# EAGLE design lcard_repeater (EAGLE 6.6.0)
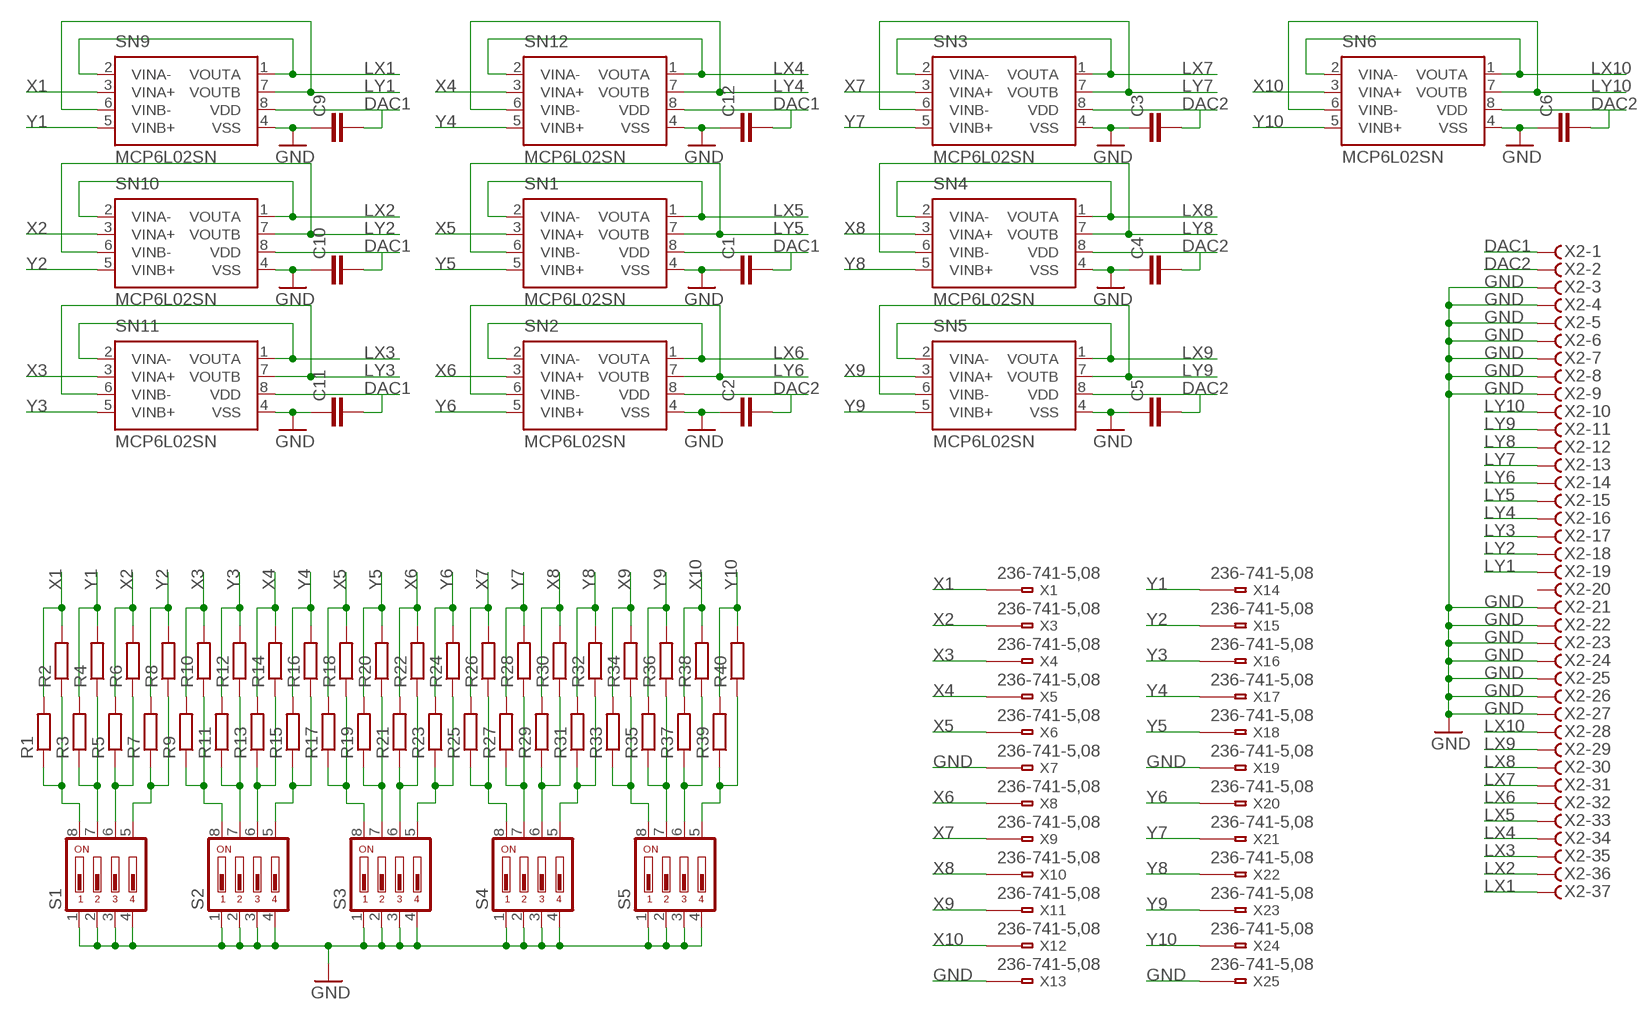
[diagram p0: schematic, sheet 1]

## Parts
C1  C-EUC1206  [C1206]
C2  C-EUC1206  [C1206]
C3  C-EUC1206  [C1206]
C4  C-EUC1206  [C1206]
C5  C-EUC1206  [C1206]
C6  C-EUC1206  [C1206]
C9  C-EUC1206  [C1206]
C10  C-EUC1206  [C1206]
C11  C-EUC1206  [C1206]
C12  C-EUC1206  [C1206]
R1  R-EU_R1206  [R1206]
R2  R-EU_R1206  [R1206]
R3  R-EU_R1206  [R1206]
R4  R-EU_R1206  [R1206]
R5  R-EU_R1206  [R1206]
R6  R-EU_R1206  [R1206]
R7  R-EU_R1206  [R1206]
R8  R-EU_R1206  [R1206]
R9  R-EU_R1206  [R1206]
R10  R-EU_R1206  [R1206]
R11  R-EU_R1206  [R1206]
R12  R-EU_R1206  [R1206]
R13  R-EU_R1206  [R1206]
R14  R-EU_R1206  [R1206]
R15  R-EU_R1206  [R1206]
R16  R-EU_R1206  [R1206]
R17  R-EU_R1206  [R1206]
R18  R-EU_R1206  [R1206]
R19  R-EU_R1206  [R1206]
R20  R-EU_R1206  [R1206]
R21  R-EU_R1206  [R1206]
R22  R-EU_R1206  [R1206]
R23  R-EU_R1206  [R1206]
R24  R-EU_R1206  [R1206]
R25  R-EU_R1206  [R1206]
R26  R-EU_R1206  [R1206]
R27  R-EU_R1206  [R1206]
R28  R-EU_R1206  [R1206]
R29  R-EU_R1206  [R1206]
R30  R-EU_R1206  [R1206]
R31  R-EU_R1206  [R1206]
R32  R-EU_R1206  [R1206]
R33  R-EU_R1206  [R1206]
R34  R-EU_R1206  [R1206]
R35  R-EU_R1206  [R1206]
R36  R-EU_R1206  [R1206]
R37  R-EU_R1206  [R1206]
R38  R-EU_R1206  [R1206]
R39  R-EU_R1206  [R1206]
R40  R-EU_R1206  [R1206]
S1  DS04  [DS-04]
S2  DS04  [DS-04]
S3  DS04  [DS-04]
S4  DS04  [DS-04]
S5  DS04  [DS-04]
SN1  MCP6L02SN  [SOIC-08LG]
SN2  MCP6L02SN  [SOIC-08LG]
SN3  MCP6L02SN  [SOIC-08LG]
SN4  MCP6L02SN  [SOIC-08LG]
SN5  MCP6L02SN  [SOIC-08LG]
SN6  MCP6L02SN  [SOIC-08LG]
SN9  MCP6L02SN  [SOIC-08LG]
SN10  MCP6L02SN  [SOIC-08LG]
SN11  MCP6L02SN  [SOIC-08LG]
SN12  MCP6L02SN  [SOIC-08LG]
X1  236-741-5,08  [236-4XX]
X2  F37DS  [F37D]
X3  236-741-5,08  [236-4XX]
X4  236-741-5,08  [236-4XX]
X5  236-741-5,08  [236-4XX]
X6  236-741-5,08  [236-4XX]
X7  236-741-5,08  [236-4XX]
X8  236-741-5,08  [236-4XX]
X9  236-741-5,08  [236-4XX]
X10  236-741-5,08  [236-4XX]
X11  236-741-5,08  [236-4XX]
X12  236-741-5,08  [236-4XX]
X13  236-741-5,08  [236-4XX]
X14  236-741-5,08  [236-4XX]
X15  236-741-5,08  [236-4XX]
X16  236-741-5,08  [236-4XX]
X17  236-741-5,08  [236-4XX]
X18  236-741-5,08  [236-4XX]
X19  236-741-5,08  [236-4XX]
X20  236-741-5,08  [236-4XX]
X21  236-741-5,08  [236-4XX]
X22  236-741-5,08  [236-4XX]
X23  236-741-5,08  [236-4XX]
X24  236-741-5,08  [236-4XX]
X25  236-741-5,08  [236-4XX]

## Nets
DAC1: C1.2 C9.2 C10.2 C11.2 C12.2 SN1.8(VDD) SN9.8(VDD) SN10.8(VDD) SN11.8(VDD) SN12.8(VDD) X2.1
DAC2: C2.2 C3.2 C4.2 C5.2 C6.2 SN2.8(VDD) SN3.8(VDD) SN4.8(VDD) SN5.8(VDD) SN6.8(VDD) X2.2
GND: C1.1 C2.1 C3.1 C4.1 C5.1 C6.1 C9.1 C10.1 C11.1 C12.1 S1.1 S1.2 S1.3 S1.4 S2.1 S2.2 S2.3 S2.4 S3.1 S3.2 S3.3 S3.4 S4.1 S4.2 S4.3 S4.4 S5.1 S5.2 S5.3 S5.4 SN1.4(VSS) SN2.4(VSS) SN3.4(VSS) SN4.4(VSS) SN5.4(VSS) SN6.4(VSS) SN9.4(VSS) SN10.4(VSS) SN11.4(VSS) SN12.4(VSS) X2.3 X2.4 X2.5 X2.6 X2.7 X2.8 X2.9 X2.21 X2.22 X2.23 X2.24 X2.25 X2.26 X2.27 X7.1@2(B1) X13.1@2(B1) X19.1@2(B1) X25.1@2(B1)
LX1: SN9.1(VOUTA) SN9.2(VINA-) X2.37
LX2: SN10.1(VOUTA) SN10.2(VINA-) X2.36
LX3: SN11.1(VOUTA) SN11.2(VINA-) X2.35
LX4: SN12.1(VOUTA) SN12.2(VINA-) X2.34
LX5: SN1.1(VOUTA) SN1.2(VINA-) X2.33
LX6: SN2.1(VOUTA) SN2.2(VINA-) X2.32
LX7: SN3.1(VOUTA) SN3.2(VINA-) X2.31
LX8: SN4.1(VOUTA) SN4.2(VINA-) X2.30
LX9: SN5.1(VOUTA) SN5.2(VINA-) X2.29
LX10: SN6.1(VOUTA) SN6.2(VINA-) X2.28
LY1: SN9.6(VINB-) SN9.7(VOUTB) X2.19
LY2: SN10.6(VINB-) SN10.7(VOUTB) X2.18
LY3: SN11.6(VINB-) SN11.7(VOUTB) X2.17
LY4: SN12.6(VINB-) SN12.7(VOUTB) X2.16
LY5: SN1.6(VINB-) SN1.7(VOUTB) X2.15
LY6: SN2.6(VINB-) SN2.7(VOUTB) X2.14
LY7: SN3.6(VINB-) SN3.7(VOUTB) X2.13
LY8: SN4.6(VINB-) SN4.7(VOUTB) X2.12
LY9: SN5.6(VINB-) SN5.7(VOUTB) X2.11
LY10: SN6.6(VINB-) SN6.7(VOUTB) X2.10
N$1: R1.1 R2.1 S1.8
N$2: R3.1 R4.1 S1.7
N$3: R5.1 R6.1 S1.6
N$4: R7.1 R8.1 S1.5
N$5: R33.1 R34.1 S5.8
N$6: R35.1 R36.1 S5.7
N$7: R37.1 R38.1 S5.6
N$8: R39.1 R40.1 S5.5
N$10: R9.1 R10.1 S2.8
N$11: R11.1 R12.1 S2.7
N$12: R13.1 R14.1 S2.6
N$13: R15.1 R16.1 S2.5
N$19: R17.1 R18.1 S3.8
N$20: R19.1 R20.1 S3.7
N$21: R21.1 R22.1 S3.6
N$22: R23.1 R24.1 S3.5
N$28: R25.1 R26.1 S4.8
N$29: R27.1 R28.1 S4.7
N$30: R29.1 R30.1 S4.6
N$31: R31.1 R32.1 S4.5
X1: R1.2 R2.2 SN9.3(VINA+) X1.1@2(B1)
X2: R5.2 R6.2 SN10.3(VINA+) X3.1@2(B1)
X3: R9.2 R10.2 SN11.3(VINA+) X4.1@2(B1)
X4: R13.2 R14.2 SN12.3(VINA+) X5.1@2(B1)
X5: R17.2 R18.2 SN1.3(VINA+) X6.1@2(B1)
X6: R21.2 R22.2 SN2.3(VINA+) X8.1@2(B1)
X7: R25.2 R26.2 SN3.3(VINA+) X9.1@2(B1)
X8: R29.2 R30.2 SN4.3(VINA+) X10.1@2(B1)
X9: R33.2 R34.2 SN5.3(VINA+) X11.1@2(B1)
X10: R37.2 R38.2 SN6.3(VINA+) X12.1@2(B1)
Y1: R3.2 R4.2 SN9.5(VINB+) X14.1@2(B1)
Y2: R7.2 R8.2 SN10.5(VINB+) X15.1@2(B1)
Y3: R11.2 R12.2 SN11.5(VINB+) X16.1@2(B1)
Y4: R15.2 R16.2 SN12.5(VINB+) X17.1@2(B1)
Y5: R19.2 R20.2 SN1.5(VINB+) X18.1@2(B1)
Y6: R23.2 R24.2 SN2.5(VINB+) X20.1@2(B1)
Y7: R27.2 R28.2 SN3.5(VINB+) X21.1@2(B1)
Y8: R31.2 R32.2 SN4.5(VINB+) X22.1@2(B1)
Y9: R35.2 R36.2 SN5.5(VINB+) X23.1@2(B1)
Y10: R39.2 R40.2 SN6.5(VINB+) X24.1@2(B1)
Unconnected: X1.1@1(A1) X2.20 X3.1@1(A1) X4.1@1(A1) X5.1@1(A1) X6.1@1(A1) X7.1@1(A1) X8.1@1(A1) X9.1@1(A1) X10.1@1(A1) X11.1@1(A1) X12.1@1(A1) X13.1@1(A1) X14.1@1(A1) X15.1@1(A1) X16.1@1(A1) X17.1@1(A1) X18.1@1(A1) X19.1@1(A1) X20.1@1(A1) X21.1@1(A1) X22.1@1(A1) X23.1@1(A1) X24.1@1(A1) X25.1@1(A1)

## Library data of the parts
C1-C6 C9-C12 = lcard_repeater:C-EU: CAPACITOR, European symbol
R1-R40 = lcard_repeater:R-EU_: RESISTOR, European symbol
S1-S5 = lcard_repeater:DS04: DIL/CODE SWITCH; OC_FARNELL: 9471570; OC_NEWARK: unknown
SN1-SN6 SN9-SN12 = lcard_repeater:MCP6L02: Universal High Brightness LED Driver Source: www.supertex.com .. led_driver_ics_SG.pdf; MPN: MXHV9910B; OC_FARNELL: unknown; OC_NEWARK: 15R9731
X1 X3-X25 = lcard_repeater:236: Anreihbare Einzelklemme 2,5 mm² 16A Rastermaß 5/5,08 | 7,5/7,62 | 10/10,16
X2 = lcard_repeater:F37?S: SUB-D; OC_FARNELL: unknown; OC_NEWARK: unknown

## Board
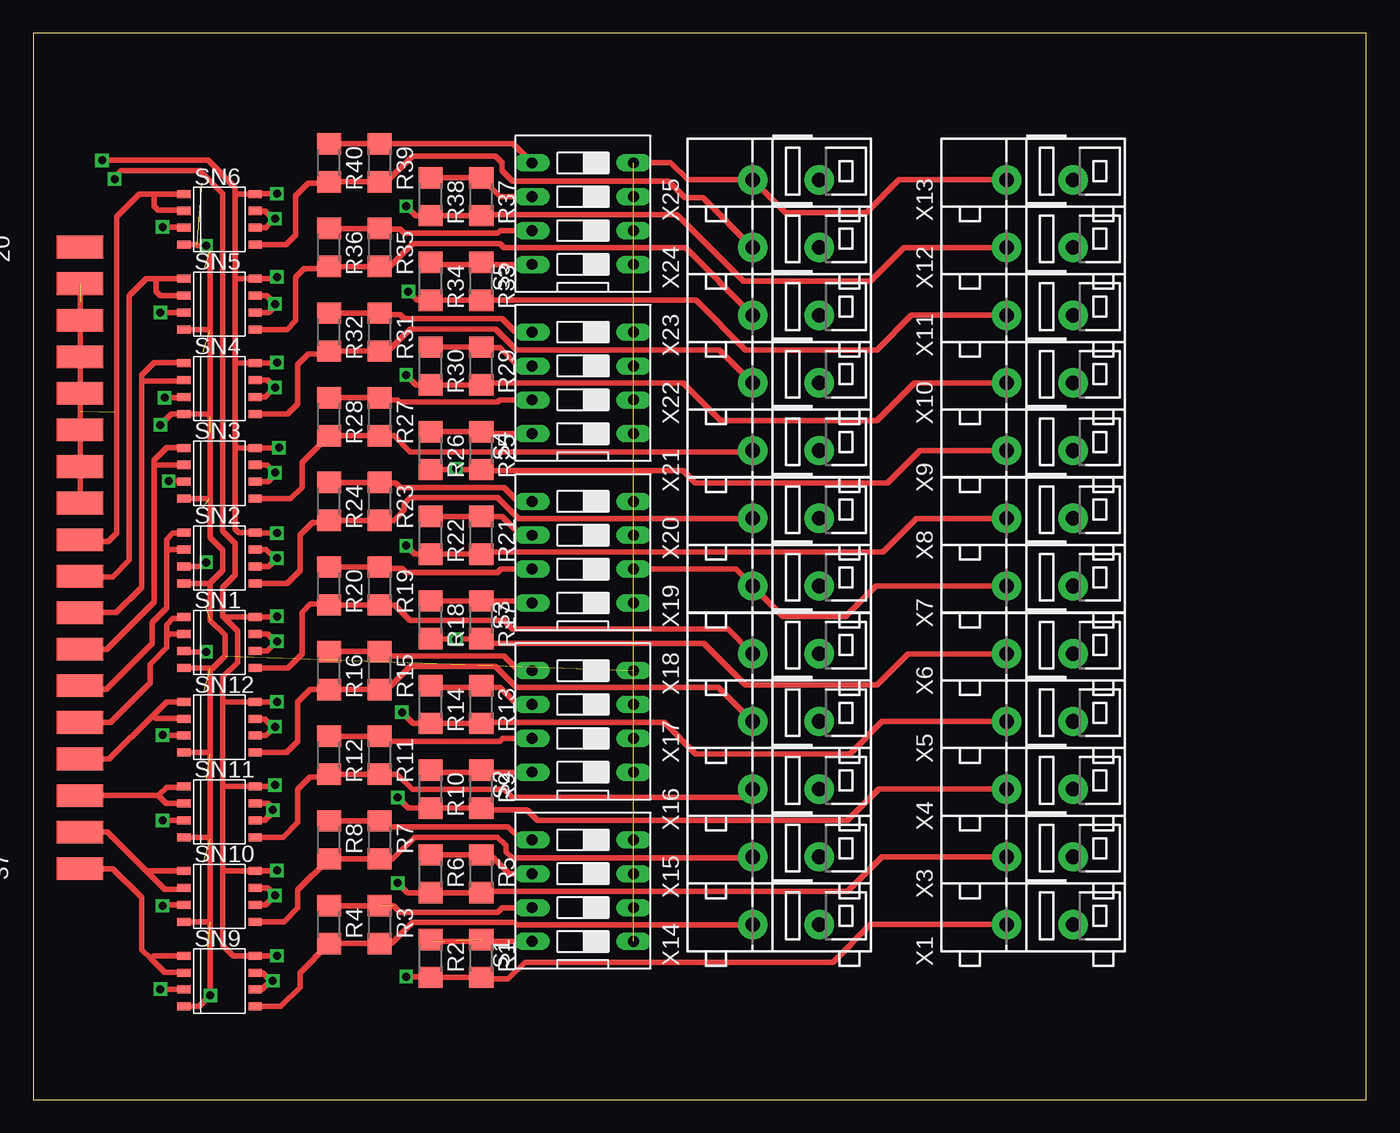
[diagram p1: board, top side]
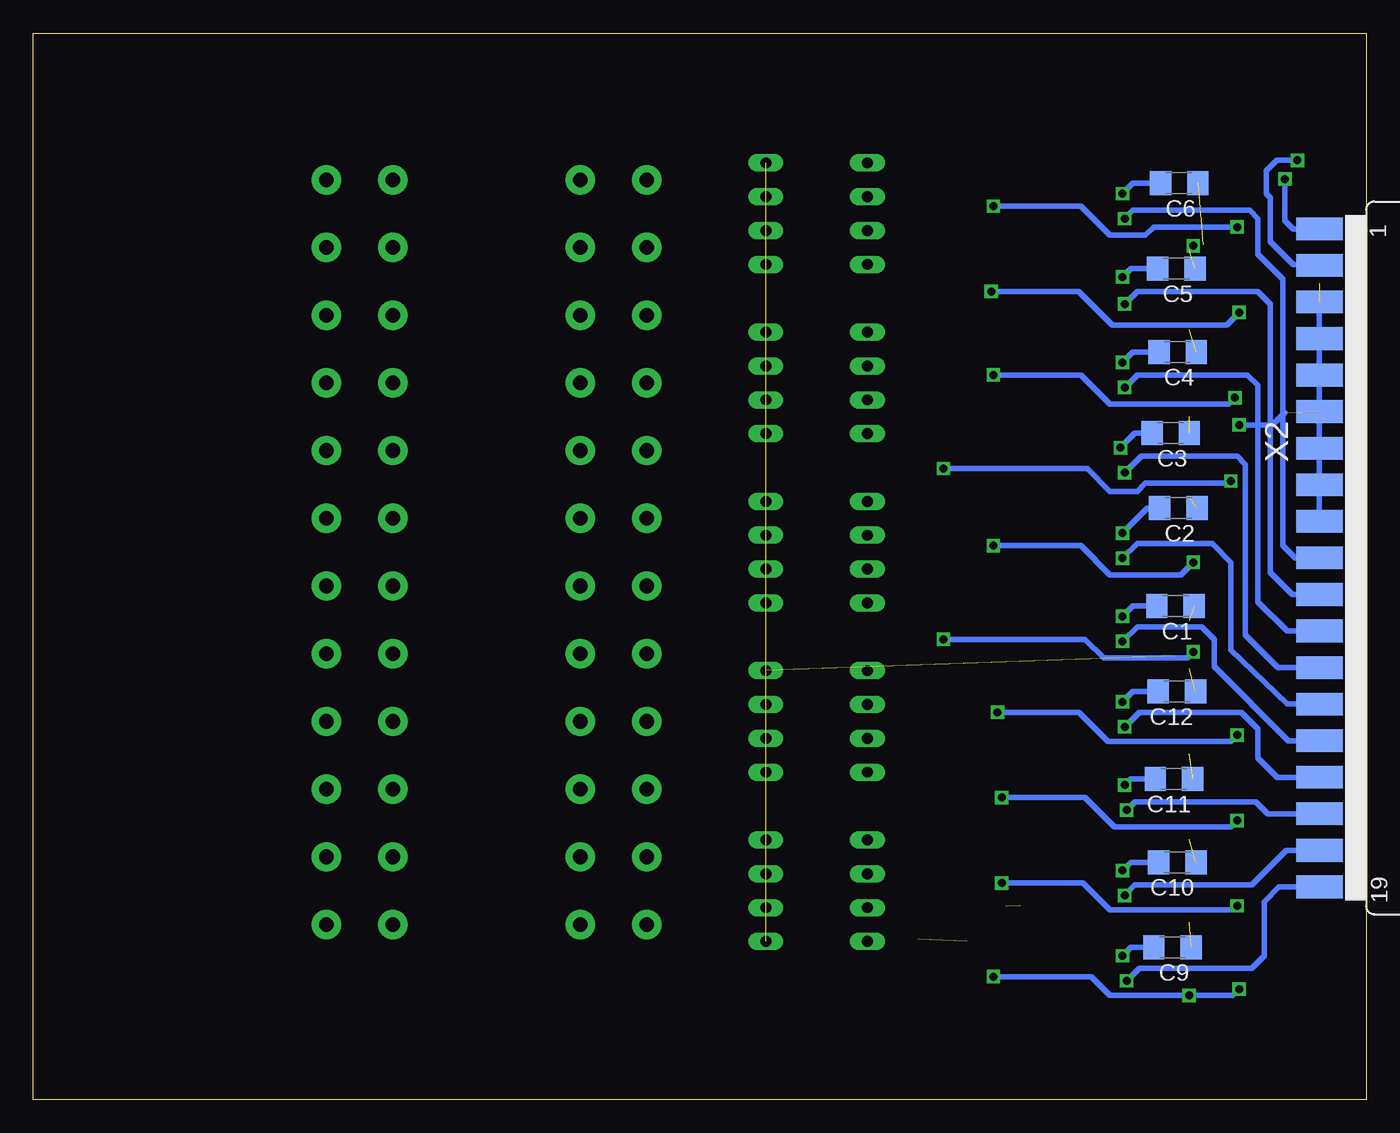
[diagram p2: board, bottom side, seen from below]

Size 100 x 80 mm. Coordinates in mm from the lower left corner, seen from the top.
Outline: 0,0 100,0 100,80 0,80 0,0
Copper layers (1*16): Top 0.035mm / dielectric 1.5mm / Bottom 0.035mm
Design rules "default": minimum track width 10mil, minimum drill 24mil, track to track 8mil, track to pad 8mil, pad to pad 8mil, via to via 8mil, smd to smd 8mil, copper to edge 40mil, drill to drill 8mil, minimum pad ring 10mil, minimum via ring 8mil, stop-mask expansion 4mil, vias tented up to drill 0mil, thermal gap 10mil

### Footprints (pad centres in the part's own frame; a part is rotated, then mirrored left to right if it is on the bottom)
C1206 = smd 1.6 x 1.8: 1 -1.4,0; 2 1.4,0
R1206 = smd 1.6 x 1.803: 1 -1.422,0; 2 1.422,0
DS-04 = drill 0.813 long: 1 -3.81,-3.81; 2 -1.27,-3.81; 3 1.27,-3.81; 4 3.81,-3.81; 5 3.81,3.81; 6 1.27,3.81; 7 -1.27,3.81; 8 -3.81,3.81
SOIC-08LG = smd 0.6 x 1: 1 -1.905,-2.675; 2 -0.635,-2.675; 3 0.635,-2.675; 4 1.905,-2.675; 5 1.905,2.675; 6 0.635,2.675; 7 -0.635,2.675; 8 -1.905,2.675
236-4XX = drill 1.1 pad 2.2: 1@1 0,-2.5; 1@2 0,2.5
F37D = smd 1.7 x 3.5: 1 -24.689,-6.045; 2 -21.946,-6.045; 3 -19.202,-6.045; 4 -16.459,-6.045; 5 -13.716,-6.045; 6 -10.973,-6.045; 7 -8.23,-6.045; 8 -5.486,-6.045; 9 -2.743,-6.045; 10 0,-6.045; 11 2.743,-6.045; 12 5.486,-6.045; 13 8.23,-6.045; 14 10.973,-6.045; 15 13.716,-6.045; 16 16.459,-6.045; 17 19.202,-6.045; 18 21.946,-6.045; 19 24.689,-6.045 | smd 1.7 x 3.5 bottom: 20 -23.317,-6.045; 21 -20.574,-6.045; 22 -17.831,-6.045; 23 -15.088,-6.045; 24 -12.344,-6.045; 25 -9.601,-6.045; 26 -6.858,-6.045; 27 -4.115,-6.045; 28 -1.372,-6.045; 29 1.372,-6.045; 30 4.115,-6.045; 31 6.858,-6.045; 32 9.601,-6.045; 33 12.344,-6.045; 34 15.088,-6.045; 35 17.831,-6.045; 36 20.574,-6.045; 37 23.317,-6.045

### Placement (x,y rotation side)
C1  14.31,37.02 180 bottom
C2  14.1,44.37 180 bottom
C3  14.67,49.99 180 bottom
C4  14.14,56.09 180 bottom
C5  14.24,62.34 180 bottom
C6  14.03,68.74 180 bottom
C9  14.53,11.41 180 bottom
C10  14.17,17.8 180 bottom
C11  14.42,24.05 180 bottom
C12  14.21,30.62 180 bottom
R1  33.61,10.59 270 top
R2  29.8,10.59 270 top
R3  25.99,13.13 270 top
R4  22.18,13.13 270 top
R5  33.61,16.94 270 top
R6  29.8,16.94 270 top
R7  25.99,19.48 270 top
R8  22.18,19.48 270 top
R9  33.61,23.29 270 top
R10  29.8,23.29 270 top
R11  25.99,25.83 270 top
R12  22.18,25.83 270 top
R13  33.61,29.64 270 top
R14  29.8,29.64 270 top
R15  25.99,32.18 270 top
R16  22.18,32.18 270 top
R17  33.61,35.99 270 top
R18  29.8,35.99 270 top
R19  25.99,38.53 270 top
R20  22.18,38.53 270 top
R21  33.61,42.34 270 top
R22  29.8,42.34 270 top
R23  25.99,44.88 270 top
R24  22.18,44.88 270 top
R25  33.61,48.69 270 top
R26  29.8,48.69 270 top
R27  25.99,51.23 270 top
R28  22.18,51.23 270 top
R29  33.61,55.04 270 top
R30  29.8,55.04 270 top
R31  25.99,57.58 270 top
R32  22.18,57.58 270 top
R33  33.61,61.39 270 top
R34  29.8,61.39 270 top
R35  25.99,63.93 270 top
R36  22.18,63.93 270 top
R37  33.61,67.74 270 top
R38  29.8,67.74 270 top
R39  25.99,70.28 270 top
R40  22.18,70.28 270 top
S1  41.23,15.67 90 top
S2  41.23,28.37 90 top
S3  41.23,41.07 90 top
S4  41.23,53.77 90 top
S5  41.23,66.47 90 top
SN1  13.97,34.29 270 top
SN2  13.97,40.64 270 top
SN3  13.97,46.99 270 top
SN4  13.97,53.34 270 top
SN5  13.97,59.69 270 top
SN6  13.97,66.04 270 top
SN9  13.97,8.89 270 top
SN10  13.97,15.24 270 top
SN11  13.97,21.59 270 top
SN12  13.97,27.94 270 top
X1  75.52,13.13 90 top
X2  -2.54,40.64 270 bottom
X3  75.52,18.21 90 top
X4  75.52,23.29 90 top
X5  75.52,28.37 90 top
X6  75.52,33.45 90 top
X7  75.52,38.53 90 top
X8  75.52,43.61 90 top
X9  75.52,48.69 90 top
X10  75.52,53.77 90 top
X11  75.52,58.85 90 top
X12  75.52,63.93 90 top
X13  75.52,69.01 90 top
X14  56.47,13.13 90 top
X15  56.47,18.21 90 top
X16  56.47,23.29 90 top
X17  56.47,28.37 90 top
X18  56.47,33.45 90 top
X19  56.47,38.53 90 top
X20  56.47,43.61 90 top
X21  56.47,48.69 90 top
X22  56.47,53.77 90 top
X23  56.47,58.85 90 top
X24  56.47,63.93 90 top
X25  56.47,69.01 90 top

### Tracks (layer width: path | path; a pad name or v marks a point on that pad's centre or on a via)
DAC1  (via drill 0.6)
  Top 0.406: 14.22,17.19 14.22,11.56 14.99,10.79 SN9.8 16.66,10.78 v18.28,10.78 | 14.22,17.19 14.22,23.59 | 14.22,23.59 14.22,30 | 14.22,17.19 14.26,17.14 SN10.8 18.24,17.14 v18.28,17.19 | 14.22,23.59 14.32,23.5 SN11.8 18.12,23.5 v18.12,23.59 | 14.22,30 14.37,29.84 SN12.8 v18.28,29.84 | 14.27,36.2 SN1.8 18.28,36.2 v18.28,36.25 | 14.27,36.2 14.22,36.25 14.22,38.44 15.16,39.38 15.16,41.72 14.22,42.66 14.22,67.97 12.5,69.69 6.56,69.69 6.09,69.22 v6.09,69.06 | 14.27,36.2 15.31,35.16 15.31,32.81 14.22,31.72 14.22,30
  Bottom 0.406: C1.2 17.51,37.02 v18.28,36.25 | C12.2 17.51,30.62 v18.28,29.84 | C11.2 17.66,24.05 v18.12,23.59 | C10.2 17.66,17.8 v18.28,17.19 | C9.2 17.65,11.41 v18.28,10.78 | v6.09,69.06 6.09,65.94 5.47,65.31 3.52,65.31 X2.1
DAC2  (via drill 0.6)
  Top 0.406: 15.16,49.06 15.16,42.81 15.42,42.55 SN2.8 16.69,42.5 v18.28,42.5 | 15.16,49.06 15.16,55.31 | 15.16,55.31 15.16,61.56 | 15.16,61.56 15.16,67.97 | 15.16,67.97 15.16,68.44 13.12,70.47 v5.16,70.47 | 15.16,67.97 15.18,67.94 SN6.8 16.67,67.97 v18.28,67.97 | 15.16,61.56 15.19,61.59 SN5.8 18.16,61.59 v18.28,61.72 | 15.16,55.31 15.22,55.24 SN4.8 18.21,55.24 v18.28,55.31 | 15.16,49.06 15.32,48.9 SN3.8 18.43,48.9 v18.44,48.91
  Bottom 0.406: C6.2 17.51,68.74 v18.28,67.97 | C5.2 17.66,62.34 v18.28,61.72 | C4.2 17.51,56.09 v18.28,55.31 | C3.2 17.35,49.99 v18.44,48.91 | C2.2 16.41,44.37 v18.28,42.5 | v5.16,70.47 6.72,70.47 7.5,69.69 7.5,67.97 7.19,67.66 7.19,64.38 5.47,62.66 3.58,62.66 X2.2
GND  (via drill 0.6)  (32 unrouted)
  Top 0.406: SN6.4 12.27,64.14 12.34,64.06 v12.97,64.06 13.28,63.75 13.28,57.81 | SN9.4 12.45,6.99 v13.28,7.81 13.28,13.28 | 13.28,13.28 13.28,19.53 | 13.28,19.53 13.28,25.94 | 13.28,25.94 13.28,32.34 | 13.28,45.16 13.28,51.25 | 13.28,51.25 13.28,57.81 | SN5.4 13.25,57.78 13.28,57.81 | 13.28,51.25 13.1,51.44 SN4.4 10.34,51.44 v9.53,50.62 | SN3.4 13.21,45.09 13.28,45.16 | SN2.4 13.11,38.73 13.28,38.75 | SN1.4 13.17,32.38 13.28,32.34 | SN10.4 13.23,13.34 13.28,13.28 | SN11.4 13.13,19.68 13.28,19.53 | SN12.4 13.18,26.04 13.28,25.94 | 13.28,38.75 13.28,35.94 14.38,34.84 14.38,33.28 13.44,32.34 13.28,32.34 | 13.28,45.16 13.28,42.19 14.22,41.25 14.22,39.69 13.28,38.75 | X7.1@2 63.22,38.53 60.94,36.25 56.25,36.25 X19.1@2 52.7,39.8 S3.2 | X13.1@2 64.95,69.01 62.5,66.56 56.42,66.56 X25.1@2 49.12,69.01 47.81,70.31 45.08,70.31 S5.4 | X2.21 X2.22 X2.23 X2.24 X2.25 X2.26 X2.27
  Bottom 0.406: X2.9 X2.8 | X2.8 | X2.8 X2.7 | X2.7 | X2.7 X2.6 X2.5 | X2.5 | X2.5 X2.4 | X2.4 | X2.4 X2.3 | X2.3 | v9.53,50.62 7.03,50.62 6.09,51.56
LX1
  Top 0.406: X2.37 5.96,17.32 8.12,15.16 8.12,11.25 8.83,10.55 | 8.83,10.55 9.84,9.53 11.29,9.53 SN9.2 | SN9.1 9.08,10.79 8.83,10.55
LX2
  Top 0.406: X2.36 5.56,20.07 8.59,17.03 | 8.59,17.03 9.84,15.78 11.2,15.78 SN10.2 | SN10.1 8.71,17.14 8.59,17.03
LX3
  Top 0.406: X2.35 9.37,22.81 | 9.37,22.81 10,23.44 11.24,23.44 SN11.1 | SN11.2 9.96,22.23 9.37,22.81
LX4
  Top 0.406: X2.34 5.71,25.55 8.98,28.83 | 8.98,28.83 10,29.84 SN12.1 | SN12.2 11.27,28.57 11.25,28.59 9.22,28.59 8.98,28.83
LX5
  Top 0.406: X2.33 5.8,28.3 8.75,31.25 8.75,32.66 10,33.91 10,34.69 | 10,34.69 10,35.62 10.47,36.09 11.19,36.09 SN1.1 | SN1.2 10.24,34.92 10,34.69
LX6
  Top 0.406: X2.32 3.23,31.04 2.97,30.78 5.47,30.78 8.91,34.22 8.91,35.78 10,36.88 10,41.09 | 10,41.09 10,42.03 10.47,42.5 11.25,42.5 SN2.1 | SN2.2 10.18,41.27 10,41.09
LX7
  Top 0.406: X2.31 5.5,33.78 9.06,37.34 9.06,47.5 | 9.06,47.5 9.06,47.97 10,48.91 11.28,48.91 SN3.1 | SN3.2 9.19,47.62 9.06,47.5
LX8
  Top 0.406: X2.30 6.21,36.52 8.12,38.44 8.12,53.91 | 8.12,53.91 8.12,54.38 9.06,55.31 11.23,55.31 SN4.1 | SN4.2 11.49,53.98 11.56,53.91 8.12,53.91
LX9
  Top 0.406: X2.29 3.56,39.22 5.94,39.22 7.19,40.47 7.19,60.31 8.47,61.59 9.06,61.59 | 9.06,61.59 SN5.1 | SN5.2 11.39,60.33 11.41,60.31 9.53,60.31 9.22,60.62 9.22,61.44 9.06,61.59
LX10
  Top 0.406: X2.28 3.64,41.88 5.62,41.88 6.25,42.5 6.25,66.25 7.95,67.94 9.06,67.94 | 9.06,67.94 SN6.1 | SN6.2 11.25,66.72 9.38,66.72 9.06,67.03 9.06,67.94
LY1  (via drill 0.6)
  Top 0.406: SN9.7 17.19,9.53 17.81,8.91 | 17.81,8.91 v17.97,8.91 | SN9.6 17.16,8.26 17.81,8.91
  Bottom 0.406: X2.19 6.55,15.95 7.66,14.84 7.66,10.78 8.59,9.84 17.03,9.84 v17.97,8.91
LY2  (via drill 0.6)
  Top 0.406: 16.71,15.94 SN10.7 17.56,15.88 v18.12,15.31 17.42,14.61 SN10.6
  Bottom 0.406: X2.18 5.99,18.69 8.59,16.09 17.34,16.09 v18.12,15.31
LY3  (via drill 0.6)
  Top 0.406: SN11.7 17.62,22.23 18.12,21.72 | 18.12,21.72 v17.97,21.72 | SN11.6 17.36,20.95 18.12,21.72
  Bottom 0.406: X2.17 7.38,21.44 8.28,22.34 17.34,22.34 v17.97,21.72
LY4  (via drill 0.6)
  Top 0.406: SN12.7 17.36,28.57 17.97,27.97 v18.12,27.97 17.46,27.3 SN12.6
  Bottom 0.406: X2.16 6.68,24.18 8.12,25.62 8.12,27.81 9.38,29.06 17.03,29.06 v18.12,27.97
LY5  (via drill 0.6)
  Top 0.406: SN1.7 17.57,34.92 18.12,34.38 v18.28,34.38 17.56,33.66 SN1.6
  Bottom 0.406: X2.15 5.83,26.92 11.41,32.5 11.41,34.53 12.34,35.47 17.19,35.47 v18.28,34.38
LY6  (via drill 0.6)
  Top 0.406: SN2.7 17.48,41.27 18.12,40.62 v18.28,40.62 17.66,40.01 SN2.6
  Bottom 0.406: X2.14 5.92,29.67 10.16,33.75 10.16,40.31 11.56,41.72 17.19,41.72 v18.28,40.62
LY7  (via drill 0.6)
  Top 0.406: SN3.7 17.53,47.62 v18.12,47.03 18.28,47.03 17.61,46.35 SN3.6
  Bottom 0.406: X2.13 6.63,32.41 9.06,34.84 9.06,47.66 9.69,48.28 16.88,48.28 v18.12,47.03
LY8  (via drill 0.6)
  Top 0.406: SN4.7 17.59,53.98 v18.12,53.44 17.39,52.7 SN4.6
  Bottom 0.406: X2.12 5.93,35.15 8.12,37.34 8.12,53.59 8.91,54.38 17.19,54.38 v18.12,53.44
LY9  (via drill 0.6)
  Top 0.406: SN5.7 17.49,60.33 v18.12,59.69 18.28,59.69 17.65,59.05 SN5.6
  Bottom 0.406: X2.11 5.55,37.9 7.19,39.53 7.19,59.69 8.12,60.62 17.19,60.62 v18.12,59.69
LY10  (via drill 0.6)
  Top 0.406: SN6.7 17.39,66.67 17.97,66.09 v18.12,66.09 17.44,65.41 SN6.6
  Bottom 0.406: X2.10 5.33,40.64 6.25,41.56 6.25,61.56 8.12,63.44 8.12,66.09 8.75,66.72 17.5,66.72 v18.12,66.09
N$1  (1 unrouted)
  Top 0.406: S1.8 29.95,11.86 R2.1
N$2  (1 unrouted)
  Top 0.406: S1.7 35.18,14.4 34.84,14.06 27.5,14.06 27.03,14.53 22.2,14.53 R4.1
N$3
  Top 0.406: S1.6 35.72,16.94 34.3,18.36 R5.1 R6.1
N$4
  Top 0.406: S1.5 36.62,19.48 35.62,20.47 26.42,20.47 R7.1 R8.1
N$5
  Top 0.406: R33.1 33.76,62.66 S5.8 29.95,62.66 R34.1
N$6
  Top 0.406: S5.7 35.04,65.2 34.84,65 27.81,65 27.5,65.31 26.03,65.31 R35.1 R36.1
N$7
  Top 0.406: R38.1 R37.1 35.03,67.74 S5.6
N$8
  Top 0.406: R40.1 R39.1 36,71.7 S5.5
N$10
  Top 0.406: S2.8 33.44,24.56 | 33.44,24.56 29.95,24.56 R10.1 | R9.1 33.59,24.71 33.44,24.56
N$11
  Top 0.406: S2.7 35.22,27.1 35,26.88 26.37,26.88 R11.1 R12.1
N$12
  Top 0.406: S2.6 36.3,29.64 35,30.94 33.75,30.94 | 33.75,30.94 29.93,30.94 R14.1 | R13.1 33.63,31.06 33.75,30.94
N$13
  Top 0.406: S2.5 36.41,32.18 35.31,33.28 26.31,33.28 R15.1 R16.1
N$19
  Top 0.406: 29.95,37.26 R18.1 R17.1 37.27,37.41 S3.8
N$20
  Top 0.406: S3.7 35.11,39.8 34.84,39.53 27.97,39.53 27.66,39.84 26.1,39.84 R19.1 R20.1
N$21
  Top 0.406: S3.6 36.57,42.34 35.16,43.75 33.59,43.75 | 33.59,43.75 29.81,43.75 R22.1 | R21.1 33.59,43.75
N$22
  Top 0.406: S3.5 36.37,44.88 35.31,45.94 27.5,45.94 27.19,46.25 26.04,46.25 R23.1 R24.1
N$28
  Top 0.406: S4.8 33.76,49.96 R25.1 R26.1
N$29
  Top 0.406: S4.7 35,52.5 34.84,52.34 27.5,52.34 27.34,52.5 26.14,52.5 R27.1 R28.1
N$30
  Top 0.406: S4.6 36.37,55.04 35,56.41 33.67,56.41 R29.1 R30.1
N$31
  Top 0.406: S4.5 36.17,57.58 35.16,58.59 27.81,58.59 27.5,58.91 26.09,58.91 R31.1 R32.1
X1  (via drill 0.6)
  Top 0.406: SN9.3 9.56,8.26 v9.53,8.28 | X1.1@2 62.82,13.13 60,10.31 36.88,10.31 35.62,9.06 33.72,9.06 R1.2 R2.2 29.75,9.22 v27.97,9.22
  Bottom 0.406: v27.97,9.22 20.62,9.22 19.22,7.81 10,7.81 v9.53,8.28
X2  (via drill 0.6)
  Top 0.406: SN10.3 9.76,14.61 v9.69,14.53 | X3.1@2 63.68,18.21 61.09,15.62 33.72,15.62 R5.2 R6.2 28.08,15.52 v27.34,16.25
  Bottom 0.406: v27.34,16.25 21.25,16.25 19.22,14.22 10,14.22 v9.69,14.53
X3  (via drill 0.6)
  Top 0.406: SN11.3 9.71,20.95 v9.69,20.94 | X4.1@2 63.45,23.29 61.09,20.94 37.81,20.94 37.03,21.72 33.76,21.72 R9.2 R10.2 28.13,21.87 v27.34,22.66
  Bottom 0.406: v27.34,22.66 21.09,22.66 18.91,20.47 10.16,20.47 v9.69,20.94
X4  (via drill 0.6)
  Top 0.406: SN12.3 9.73,27.3 v9.69,27.34 | X5.1@2 63.68,28.37 61.25,25.94 49.69,25.94 47.34,28.28 33.68,28.28 R13.2 R14.2 28.5,28.22 v27.66,29.06
  Bottom 0.406: v27.66,29.06 21.56,29.06 19.38,26.88 10.16,26.88 v9.69,27.34
X5  (via drill 0.6)
  Top 0.406: SN1.3 11.36,33.59 v12.97,33.59 | X6.1@2 65.64,33.45 63.28,31.09 53.44,31.09 50.31,34.22 33.61,34.22 R17.2 R18.2 31.68,34.57 v31.72,34.53
  Bottom 0.406: v31.72,34.53 21.09,34.53 19.69,33.12 13.44,33.12 v12.97,33.59
X6  (via drill 0.6)
  Top 0.406: SN2.3 12.66,40.01 v12.97,40.31 | X8.1@2 66.27,43.61 63.75,41.09 33.79,41.09 R21.2 R22.2 28.61,40.92 v27.97,41.56
  Bottom 0.406: v27.97,41.56 21.41,41.56 19.22,39.38 13.91,39.38 v12.97,40.31
X7  (via drill 0.6)
  Top 0.406: SN3.3 11.25,46.4 11.25,46.41 v10.16,46.41 | X9.1@2 66.5,48.69 64.06,46.25 49.69,46.25 48.75,47.19 33.69,47.19 R25.2 R26.2 31.64,47.27 v31.72,47.34
  Bottom 0.406: v31.72,47.34 20.94,47.34 19.22,45.62 17.19,45.62 16.56,46.25 10.31,46.25 v10.16,46.41
X8  (via drill 0.6)
  Top 0.406: SN4.3 11.4,52.81 11.41,52.81 11.25,52.66 v9.84,52.66 | X10.1@2 66.11,53.77 63.28,50.94 51.56,50.94 48.75,53.75 33.75,53.75 R29.2 R30.2 28.73,53.62 v27.97,54.38
  Bottom 0.406: v27.97,54.38 21.41,54.38 19.22,52.19 10.31,52.19 v9.84,52.66
X9  (via drill 0.6)
  Top 0.406: SN5.3 11.29,59.06 v9.53,59.06 | X11.1@2 65.88,58.85 63.28,56.25 53.44,56.25 49.72,59.97 R33.2 R34.2 28.78,59.97 v28.12,60.62
  Bottom 0.406: v28.12,60.62 21.56,60.62 19.06,58.12 10.47,58.12 v9.53,59.06
X10  (via drill 0.6)
  Top 0.406: X12.1@2 65.33,63.93 62.81,61.41 53.28,61.41 48.28,66.41 33.7,66.41 R37.2 R38.2 28.68,66.32 v27.97,67.03 | v9.69,65.47 11.23,65.47 SN6.3
  Bottom 0.406: v27.97,67.03 21.41,67.03 19.22,64.84 16.56,64.84 15.94,65.47 v9.69,65.47
Y1
  Top 0.406: SN9.5 18.55,6.99 20,8.44 20,9.52 R4.2 R3.2 26.86,11.71 28.44,13.28 36.09,13.28 36.25,13.12 X14.1@2
Y2
  Top 0.406: SN10.5 18.8,13.34 19.84,14.38 19.84,15.72 R8.2 R7.2 26.96,18.06 28.59,19.69 34.84,19.69 35.47,19.06 35.47,18.59 35.94,18.12 53.89,18.12 X15.1@2
Y3
  Top 0.406: SN11.5 18.75,19.68 19.84,20.78 19.84,23.28 20.78,24.22 21.99,24.22 R12.2 R11.2 27.31,24.41 28.44,23.28 35.31,23.28 35.94,22.66 53.34,22.66 X16.1@2
Y4
  Top 0.406: SN12.5 19,26.04 19.84,26.88 19.84,29.84 20.78,30.78 22.16,30.78 R16.2 R15.2 26.54,30.76 28.28,32.5 34.69,32.5 36.25,30.94 51.4,30.94 X17.1@2
Y5
  Top 0.406: SN1.5 19.1,32.38 20.16,33.44 20.16,36.56 20.78,37.19 22.1,37.19 R20.2 R19.2 27.11,37.11 28.28,35.94 35.31,35.94 35.94,35.31 52.11,35.31 X18.1@2
Y6
  Top 0.406: SN2.5 19.05,38.73 20,39.69 20,42.34 20.94,43.28 22.01,43.28 R24.2 R23.2 27.05,43.46 27.81,44.22 27.81,44.69 28.28,45.16 34.84,45.16 36.41,43.59 53.96,43.59 X20.1@2
Y7
  Top 0.406: SN3.5 19.3,45.09 20.16,45.94 20.16,47.78 R28.2 R27.2 27.07,49.81 28.28,48.59 53.88,48.59 X21.1@2
Y8
  Top 0.406: SN4.5 19.09,51.44 19.84,52.19 19.84,55.16 20.62,55.94 21.96,55.94 R32.2 R31.2 26.62,56.16 28.28,57.81 34.69,57.81 36.25,56.25 51.49,56.25 X22.1@2
Y9
  Top 0.406: SN5.5 19.04,57.78 19.69,58.44 19.69,61.72 20.31,62.34 22.02,62.34 R36.2 R35.2 26.73,62.51 28.44,64.22 35,64.22 35.31,63.91 48.91,63.91 X23.1@2
Y10
  Top 0.406: SN6.5 18.98,64.14 19.69,64.84 19.69,67.81 20.62,68.75 22.08,68.75 R40.2 R39.2 26.51,68.86 28.44,70.78 34.69,70.78 35.16,70.31 35.16,69.69 35.94,68.91 47.66,68.91 48.91,67.66 50.24,67.66 X24.1@2